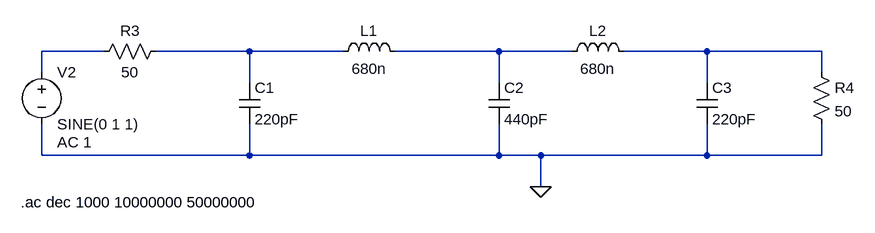
[diagram p0: schematic LC Lowpass Filter.asc]
LC Lowpass Filter.asc, the LTspice schematic file:
Version 4
SHEET 1 1176 712
WIRE 16 464 -80 464
WIRE 240 464 96 464
WIRE 384 464 240 464
WIRE 624 464 464 464
WIRE 736 464 624 464
WIRE 944 464 816 464
WIRE 1120 464 944 464
WIRE -80 496 -80 464
WIRE 1120 496 1120 464
WIRE 240 512 240 464
WIRE 624 512 624 464
WIRE 944 512 944 464
WIRE -80 624 -80 576
WIRE 240 624 240 576
WIRE 240 624 -80 624
WIRE 624 624 624 576
WIRE 624 624 240 624
WIRE 688 624 624 624
WIRE 944 624 944 576
WIRE 944 624 688 624
WIRE 1120 624 1120 576
WIRE 1120 624 944 624
WIRE 688 672 688 624
FLAG 688 672 0
SYMBOL res 112 448 R90
WINDOW 0 0 56 VBottom 2
WINDOW 3 32 56 VTop 2
SYMATTR InstName R3
SYMATTR Value 50
SYMBOL res 1104 480 R0
SYMATTR InstName R4
SYMATTR Value 50
SYMBOL voltage -80 480 R0
WINDOW 123 24 124 Left 2
WINDOW 39 0 0 Left 2
SYMATTR Value2 AC 1
SYMATTR InstName V2
SYMATTR Value SINE(0 1 1)
SYMBOL cap 224 512 R0
SYMATTR InstName C1
SYMATTR Value 220pF
SYMBOL cap 608 512 R0
SYMATTR InstName C2
SYMATTR Value 440pF
SYMBOL cap 928 512 R0
SYMATTR InstName C3
SYMATTR Value 220pF
SYMBOL ind 368 480 R270
WINDOW 0 32 56 VTop 2
WINDOW 3 5 56 VBottom 2
SYMATTR InstName L1
SYMATTR Value 680n
SYMBOL ind 720 480 R270
WINDOW 0 32 56 VTop 2
WINDOW 3 5 56 VBottom 2
SYMATTR InstName L2
SYMATTR Value 680n
TEXT -112 696 Left 2 !.ac dec 1000 10000000 50000000

The netlist it stands for:
* LC Lowpass Filter.asc
R3 N002 N001 50
R4 N004 0 50
V2 N001 0 SINE(0 1 1) AC 1
C1 N002 0 220pF
C2 N003 0 440pF
C3 N004 0 220pF
L1 N002 N003 680n
L2 N003 N004 680n
.ac dec 1000 10000000 50000000
.backanno
.end